# EAGLE design Analog_CAN_Board (EAGLE 8.4.2)
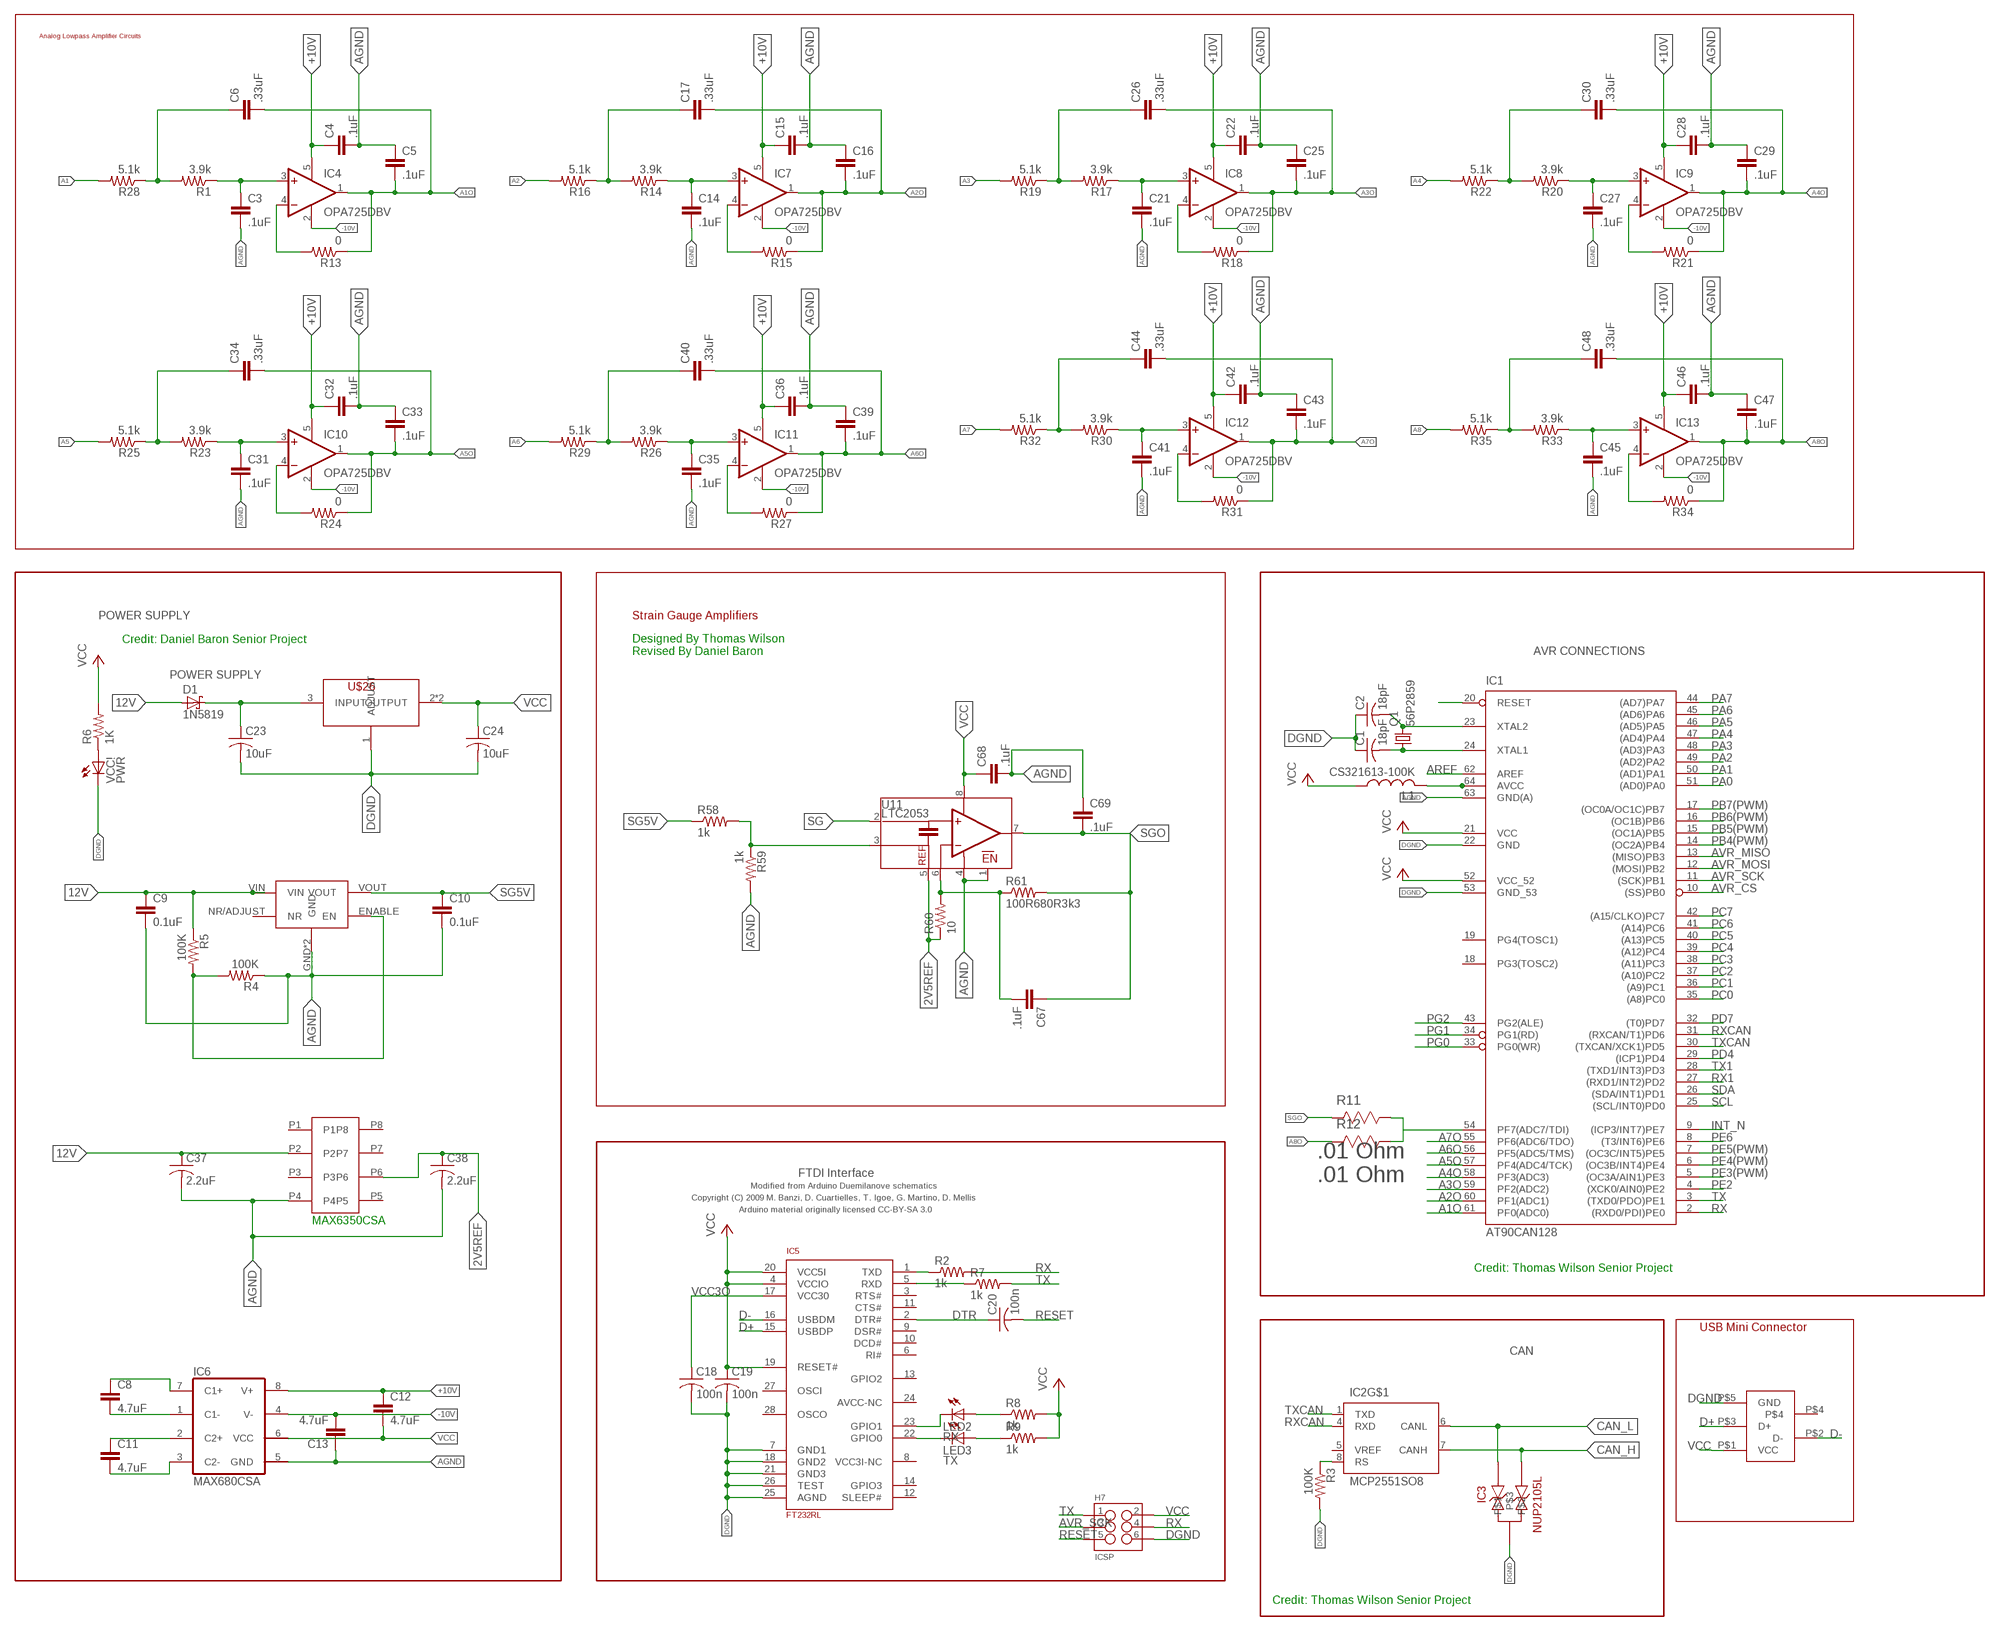
[diagram p0: schematic, sheet 1, part 1 of 2]
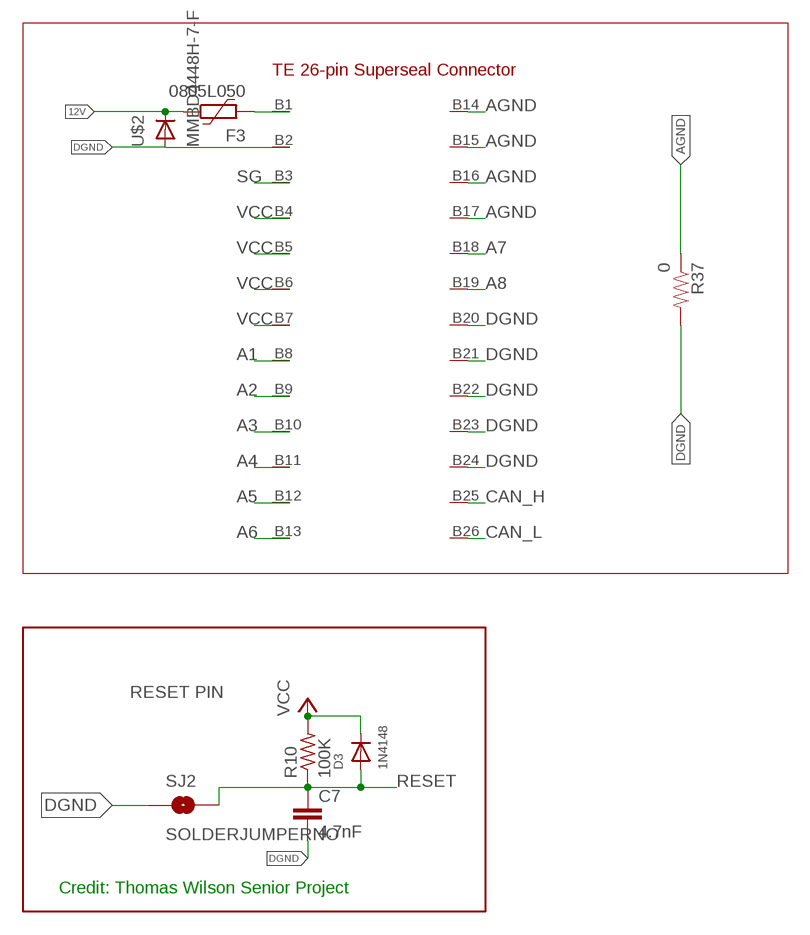
[diagram p1: schematic, sheet 1, part 2 of 2]

## Parts
C1  18pF  C-USC0805  [C0805]
C2  18pF  C-USC0805  [C0805]
C3  .1uF  CAP0603-CAP  [0603-CAP]
C4  .1uF  CAP0603-CAP  [0603-CAP]
C5  .1uF  CAP0603-CAP  [0603-CAP]
C6  .33uF  CAP0603-CAP  [0603-CAP]
C7  4.7nF  CAP0603-CAP  [0603-CAP]
C8  4.7uF  CAP0603-CAP  [0603-CAP]
C9  0.1uF  C-EUC0603  [C0603]
C10  0.1uF  C-EUC0603  [C0603]
C11  4.7uF  CAP0603-CAP  [0603-CAP]
C12  4.7uF  CAP0603-CAP  [0603-CAP]
C13  4.7uF  CAP0603-CAP  [0603-CAP]
C14  .1uF  CAP0603-CAP  [0603-CAP]
C15  .1uF  CAP0603-CAP  [0603-CAP]
C16  .1uF  CAP0603-CAP  [0603-CAP]
C17  .33uF  CAP0603-CAP  [0603-CAP]
C18  100n  C-USC0805  [C0805]
C19  100n  C-USC0805  [C0805]
C20  100n  C-USC0805  [C0805]
C21  .1uF  CAP0603-CAP  [0603-CAP]
C22  .1uF  CAP0603-CAP  [0603-CAP]
C23  10uF  C-USC0603  [C0603]
C24  10uF  C-USC0603  [C0603]
C25  .1uF  CAP0603-CAP  [0603-CAP]
C26  .33uF  CAP0603-CAP  [0603-CAP]
C27  .1uF  CAP0603-CAP  [0603-CAP]
C28  .1uF  CAP0603-CAP  [0603-CAP]
C29  .1uF  CAP0603-CAP  [0603-CAP]
C30  .33uF  CAP0603-CAP  [0603-CAP]
C31  .1uF  CAP0603-CAP  [0603-CAP]
C32  .1uF  CAP0603-CAP  [0603-CAP]
C33  .1uF  CAP0603-CAP  [0603-CAP]
C34  .33uF  CAP0603-CAP  [0603-CAP]
C35  .1uF  CAP0603-CAP  [0603-CAP]
C36  .1uF  CAP0603-CAP  [0603-CAP]
C37  2.2uF  C-USC0603  [C0603]
C38  2.2uF  C-USC0603  [C0603]
C39  .1uF  CAP0603-CAP  [0603-CAP]
C40  .33uF  CAP0603-CAP  [0603-CAP]
C41  .1uF  CAP0603-CAP  [0603-CAP]
C42  .1uF  CAP0603-CAP  [0603-CAP]
C43  .1uF  CAP0603-CAP  [0603-CAP]
C44  .33uF  CAP0603-CAP  [0603-CAP]
C45  .1uF  CAP0603-CAP  [0603-CAP]
C46  .1uF  CAP0603-CAP  [0603-CAP]
C47  .1uF  CAP0603-CAP  [0603-CAP]
C48  .33uF  CAP0603-CAP  [0603-CAP]
C67  .1uF  CAP0603-CAP  [0603-CAP]
C68  .1uF  CAP0603-CAP  [0603-CAP]
C69  .1uF  CAP0603-CAP  [0603-CAP]
D1  1N5819  1N5819-B  [DO41-7.6]
D3  1N4148  DIODESOD-123  [SOD-123]
F3  0805L050  [0805L]
H7  ICSP  M03X2SMD_FCI  [2X3_SMD_FCI_54202-G30]
IC1  AT90CAN128  [TQFP64]
IC2  MCP2551SO8  [SO08]
IC3  NUP2105L  [SOT-23]
IC4  OPA725DBV  [SOT23-5]
IC5  FT232RL  [SSOP28]
IC6  MAX680CSA  [SO08]
IC7  OPA725DBV  [SOT23-5]
IC8  OPA725DBV  [SOT23-5]
IC9  OPA725DBV  [SOT23-5]
IC10  OPA725DBV  [SOT23-5]
IC11  OPA725DBV  [SOT23-5]
IC12  OPA725DBV  [SOT23-5]
IC13  OPA725DBV  [SOT23-5]
L1  CS321613-100K  L-USL3216C  [L3216C]
LED2  RX  LEDCHIPLED_0805  [CHIPLED_0805]
LED3  TX  LEDCHIPLED_0805  [CHIPLED_0805]
Q1  56P2859  CRYSTALSMD  [HC49UP]
R1  3.9k  RESISTOR0603  [0603-RES]
R2  1k  R-US_R0805  [R0805]
R3  100K  R-US_R0805  [R0805]
R4  100K  R-US_M0805  [M0805]
R5  100K  R-US_M0805  [M0805]
R6  1K  R-US_R0805  [R0805]
R7  1k  R-US_R0805  [R0805]
R8  1k  R-US_R0805  [R0805]
R9  1k  R-US_R0805  [R0805]
R10  100K  R-US_R0805  [R0805]
R11  .01 Ohm  WSLP0603R0100FEA  [RESC1608X60N]
R12  .01 Ohm  WSLP0603R0100FEA  [RESC1608X60N]
R13  0  RESISTOR0603  [0603-RES]
R14  3.9k  RESISTOR0603  [0603-RES]
R15  0  RESISTOR0603  [0603-RES]
R16  5.1k  RESISTOR0603  [0603-RES]
R17  3.9k  RESISTOR0603  [0603-RES]
R18  0  RESISTOR0603  [0603-RES]
R19  5.1k  RESISTOR0603  [0603-RES]
R20  3.9k  RESISTOR0603  [0603-RES]
R21  0  RESISTOR0603  [0603-RES]
R22  5.1k  RESISTOR0603  [0603-RES]
R23  3.9k  RESISTOR0603  [0603-RES]
R24  0  RESISTOR0603  [0603-RES]
R25  5.1k  RESISTOR0603  [0603-RES]
R26  3.9k  RESISTOR0603  [0603-RES]
R27  0  RESISTOR0603  [0603-RES]
R28  5.1k  RESISTOR0603  [0603-RES]
R29  5.1k  RESISTOR0603  [0603-RES]
R30  3.9k  RESISTOR0603  [0603-RES]
R31  0  RESISTOR0603  [0603-RES]
R32  5.1k  RESISTOR0603  [0603-RES]
R33  3.9k  RESISTOR0603  [0603-RES]
R34  0  RESISTOR0603  [0603-RES]
R35  5.1k  RESISTOR0603  [0603-RES]
R37  0  RESISTOR0603  [0603-RES]
R58  1k  RESISTOR0603  [0603-RES]
R59  1k  RESISTOR0603  [0603-RES]
R60  10  RESISTOR0603  [0603-RES]
R61  100R680R3k3  RESISTOR0603  [0603-RES]
SJ2  SOLDERJUMPERNO  [SJ_2S-NO]
U11  LTC2053  [MSOP8]
U$1  1734753-1_MINIUSB_CON  [1734753-1_MINIUSB_CON]
U$2  MMBD4448H-7-F  [SOT23-3]
U$3  SUPERSEAL1.0_26POS  [SUPERSEAL1.0_26POS]
U$5  REG-104GA-5  [REG104GA-5]
U$10V2V5  MAX6350CSA  [8-SOIC]
U$26  NCP1117  [SOT-223-4]
VCC!  PWR  LEDCHIPLED_0805  [CHIPLED_0805]

## Nets
2V5REF: C38.1 R60.1 U11.5(REF) U$10V2V5.P6
5V_REG_IN: C23.1 D1.C U$26.3(INPUT)
12V: C9.1 C37.1 D1.A F3.1 R5.1 U$2.3(C) U$5.VIN U$10V2V5.P2
+10V: C4.1 C12.1 C15.1 C22.1 C28.1 C32.1 C36.1 C42.1 C46.1 IC4.5(V+) IC6.8(V+) IC7.5(V+) IC8.5(V+) IC9.5(V+) IC10.5(V+) IC11.5(V+) IC12.5(V+) IC13.5(V+)
-10V: C13.2 IC4.2(V-) IC6.4(V-) IC7.2(V-) IC8.2(V-) IC9.2(V-) IC10.2(V-) IC11.2(V-) IC12.2(V-) IC13.2(V-)
A1: R28.2 U$3.B8
A1O: C5.2 C6.2 IC1.61(PF0(ADC0)) IC4.1(OUT) R13.1
A2: R16.2 U$3.B9
A2O: C16.2 C17.2 IC1.60(PF1(ADC1)) IC7.1(OUT) R15.1
A3: R19.2 U$3.B10
A3O: C25.2 C26.2 IC1.59(PF2(ADC2)) IC8.1(OUT) R18.1
A4: R22.2 U$3.B11
A4O: C29.2 C30.2 IC1.58(PF3(ADC3)) IC9.1(OUT) R21.1
A5: R25.2 U$3.B12
A5O: C33.2 C34.2 IC1.57(PF4(ADC4/TCK)) IC10.1(OUT) R24.1
A6: R29.2 U$3.B13
A6O: C39.2 C40.2 IC1.56(PF5(ADC5/TMS)) IC11.1(OUT) R27.1
A7: R32.2 U$3.B18
A7O: C43.2 C44.2 IC1.55(PF6(ADC6/TDO)) IC12.1(OUT) R31.1
A8: R35.2 U$3.B19
A8O: C47.2 C48.2 IC13.1(OUT) R12.2 R34.1
AGND: C3.2 C4.2 C5.1 C9.2 C10.2 C13.1 C14.2 C15.2 C16.1 C21.2 C22.2 C25.1 C27.2 C28.2 C29.1 C31.2 C32.2 C33.1 C35.2 C36.2 C37.2 C38.2 C39.1 C41.2 C42.2 C43.1 C45.2 C46.2 C47.1 C68.2 C69.1 IC1.63(GND(A)) IC6.5(GND) R4.1 R37.1 R59.2 U11.1(EN) U11.4(V-) U$3.B14 U$3.B15 U$3.B16 U$3.B17 U$5.GND U$5.HEATGND(GND) U$10V2V5.P4
AREF: IC1.62(AREF)
AVR_CS: IC1.10((SS)PB0)
AVR_MISO: IC1.13((MISO)PB3)
AVR_MOSI: IC1.12((MOSI)PB2)
AVR_SCK: H7.3 IC1.11((SCK)PB1)
CAN_H: IC2.7(CANH) IC3.2 U$3.B25
CAN_L: IC2.6(CANL) IC3.1 U$3.B26
D+: IC5.15(USBDP) U$1.P$3(D+)
D-: IC5.16(USBDM) U$1.P$2(D-)
DGND: C1.1 C2.1 C7.2 C18.2 C19.2 C23.2 C24.2 H7.6 IC1.22(GND) IC1.53(GND_53) IC3.3 IC5.7(GND1) IC5.18(GND2) IC5.21(GND3) IC5.25(AGND) IC5.26(TEST) R3.2 R37.2 SJ2.1 U$1.P$5(GND) U$2.1(A) U$3.B2 U$3.B20 U$3.B21 U$3.B22 U$3.B23 U$3.B24 U$26.1(ADJUST) VCC!.C
DTR: C20.1 IC5.2(DTR#)
INT_N: IC1.9((ICP3/INT7)PE7)
M8RXD: IC5.1(TXD) R2.1
M8TXD: IC5.5(RXD) R7.1
N$1: F3.2 U$3.B1
N$2: R4.2 R5.2 U$5.ENABLE(EN)
N$5: C6.1 R1.2 R28.1
N$6: IC2.8(RS) R3.1
N$9: R6.1 VCC!.A
N$11: C1.2 IC1.24(XTAL1) Q1.1
N$17: C3.1 IC4.3(+IN) R1.1
N$18: IC1.54(PF7(ADC7/TDI)) R11.1 R12.1
N$19: IC4.4(-IN) R13.2
N$20: C8.1 IC6.7(C1+)
N$21: C11.1 IC6.2(C2+)
N$22: IC1.64(AVCC) L1.2
N$23: C8.2 IC6.1(C1-)
N$24: C11.2 IC6.3(C2-)
N$25: C14.1 IC7.3(+IN) R14.1
N$26: IC7.4(-IN) R15.2
N$27: C17.1 R14.2 R16.1
N$28: R58.2 R59.1 U11.3(+IN)
N$29: C67.2 R60.2 R61.1 U11.6(RG)
N$30: C21.1 IC8.3(+IN) R17.1
N$31: IC8.4(-IN) R18.2
N$32: IC5.23(GPIO1) LED2.C
N$33: C26.1 R17.2 R19.1
N$34: IC5.22(GPIO0) LED3.C
N$35: LED2.A R8.1
N$36: LED3.A R9.1
N$37: C27.1 IC9.3(+IN) R20.1
N$38: IC9.4(-IN) R21.2
N$39: C30.1 R20.2 R22.1
N$40: C31.1 IC10.3(+IN) R23.1
N$41: IC10.4(-IN) R24.2
N$42: C34.1 R23.2 R25.1
N$43: C35.1 IC11.3(+IN) R26.1
N$44: IC11.4(-IN) R27.2
N$45: C40.1 R26.2 R29.1
N$46: C41.1 IC12.3(+IN) R30.1
N$47: IC12.4(-IN) R31.2
N$48: C44.1 R30.2 R32.1
N$49: C45.1 IC13.3(+IN) R33.1
N$50: IC13.4(-IN) R34.2
N$51: C48.1 R33.2 R35.1
PA0: IC1.51((AD0)PA0)
PA1: IC1.50((AD1)PA1)
PA2: IC1.49((AD2)PA2)
PA3: IC1.48((AD3)PA3)
PA4: IC1.47((AD4)PA4)
PA5: IC1.46((AD5)PA5)
PA6: IC1.45((AD6)PA6)
PA7: IC1.44((AD7)PA7)
PB4(PWM): IC1.14((OC2A)PB4)
PB5(PWM): IC1.15((OC1A)PB5)
PB6(PWM): IC1.16((OC1B)PB6)
PB7(PWM): IC1.17((OC0A/OC1C)PB7)
PC0: IC1.35((A8)PC0)
PC1: IC1.36((A9)PC1)
PC2: IC1.37((A10)PC2)
PC3: IC1.38((A11)PC3)
PC4: IC1.39((A12)PC4)
PC5: IC1.40((A13)PC5)
PC6: IC1.41((A14)PC6)
PC7: IC1.42((A15/CLKO)PC7)
PD4: IC1.29((ICP1)PD4)
PD7: IC1.32((T0)PD7)
PE2: IC1.4((XCK0/AIN0)PE2)
PE3(PWM): IC1.5((OC3A/AIN1)PE3)
PE4(PWM): IC1.6((OC3B/INT4)PE4)
PE5(PWM): IC1.7((OC3C/INT5)PE5)
PE6: IC1.8((T3/INT6)PE6)
PG0: IC1.33(PG0(WR))
PG1: IC1.34(PG1(RD))
PG2: IC1.43(PG2(ALE))
RESET: C7.1 C20.2 D3.A H7.5 IC1.20(RESET) R10.1 SJ2.2
RX: H7.4 IC1.2((RXD0/PDI)PE0) R2.2
RX1: IC1.27((RXD1/INT2)PD2)
RXCAN: IC1.31((RXCAN/T1)PD6) IC2.4(RXD)
SCL: IC1.25((SCL/INT0)PD0)
SDA: IC1.26((SDA/INT1)PD1)
SG: U11.2(-IN) U$3.B3
SG5V: C10.1 R58.1 U$5.VOUT
SGO: C67.1 C69.2 R11.2 R61.2 U11.7(OUT)
TX: H7.1 IC1.3((TXD0/PDO)PE1) R7.2
TX1: IC1.28((TXD1/INT3)PD3)
TXCAN: IC1.30((TXCAN/XCK1)PD5) IC2.1(TXD)
VCC: C12.2 C19.1 C24.1 C68.1 D3.C H7.2 IC1.21(VCC) IC1.52(VCC_52) IC5.4(VCCIO) IC5.19(RESET#) IC5.20(VCC5I) IC6.6(VCC) L1.1 R6.2 R8.2 R9.2 R10.2 U11.8(V+) U$1.P$1(VCC) U$3.B4 U$3.B5 U$3.B6 U$3.B7 U$26.2(OUTPUT) U$26.4(OUTPUT)
VCC3O: C18.1 IC5.17(VCC30)
XTAL1: C2.2 IC1.23(XTAL2) Q1.2
Unconnected: IC1.18(PG3(TOSC2)) IC1.19(PG4(TOSC1)) IC2.5(VREF) IC5.3(RTS#) IC5.6(RI#) IC5.8(VCC3I-NC) IC5.9(DSR#) IC5.10(DCD#) IC5.11(CTS#) IC5.12(SLEEP#) IC5.13(GPIO2) IC5.14(GPIO3) IC5.24(AVCC-NC) IC5.27(OSCI) IC5.28(OSCO) U$1.P$4 U$5.NR/ADJUST(NR) U$10V2V5.P1 U$10V2V5.P3 U$10V2V5.P5 U$10V2V5.P7 U$10V2V5.P8

## Notes on the sheet
- Analog Lowpass Amplifier Circuits
- TE 26-pin Superseal Connector
- POWER SUPPLY | Strain Gauge Amplifiers
- Credit: Daniel Baron Senior Project
- Designed By Thomas Wilson
  Revised By Daniel Baron
- AVR CONNECTIONS
- POWER SUPPLY
- RESET PIN
- Credit: Thomas Wilson Senior Project
- FTDI Interface
- Modified from Arduino Duemilanove schematics
- Copyright (C) 2009 M. Banzi, D. Cuartielles, T. Igoe, G. Martino, D. Mellis
- Arduino material originally licensed CC-BY-SA 3.0
- MAX6350CSA
- Credit: Thomas Wilson Senior Project
- USB Mini Connector
- CAN
- Credit: Thomas Wilson Senior Project

## Power pins joined to a net without a drawn wire
AGND: IC2.2(GND)
VCC: IC2.3(VCC)

## Library data of the parts
C1 C2 C18-C20 C23 C24 C37 C38 = rcl:C-US: CAPACITOR, American symbol
C3-C6 C8 C11-C17 C21 C22 C25-C36 C39-C48 C67-C69 = SparkFun-Passives:CAP: Capacitor Standard 0603 ceramic capacitor, and 0.1" leaded capacitor.
C7 = SparkFun-Capacitors:CAP: Capacitor Standard 0603 ceramic capacitor, and 0.1" leaded capacitor.
C9 C10 = rcl:C-EU: CAPACITOR, European symbol
D1 = diode:1N581*: 1.0A SCHOTTKY BARRIER RECTIFIER Source: http://www.diodes.com/datasheets/ds23001.pdf
D3 = adafruit:DIODE: Diode SMADIODE - SMA Surface Mount Package 20V 1A Schottky Diode Digikey: 641-1014-6-ND DO-1N4148 - Through Hole Small Current Diode SOD-123 20V 1 A (.5mV Vf) Schottky Diode - Digikey: MBRX120TPMSCT-ND SOD-323 10V 570mA (.38mV Vf, 3ns) Schottky Diode - Digikey: ZLLS410CT-ND SOD-523 30V 30mA Schottky Diode (RB751S-40TE61) - Digikey: RB751S-40TE61CT-ND SOT23-R/W - SOT23 Package (R = Solder Paste/Reflow Ovens, W = Hand-Soldering) BAT54Film 40V 300mA - Digikey: 497-7162-1-ND
F3 = LittleFuse:?: Polyfuse Resettable PTC Source: http://www.littelfuse.com/products/resettable-ptcs.aspx; MF: Littelfuse; MPN: 0805L050; OC_FARNELL: 1832103; OC_NEWARK: 18M4776
H7 = SparkFun-Connectors:M03X2: 2x3 .1" header. Shrouded, with keying- CONN-10681 SMT- CONN-11415 Pogo pins- HW-11044
IC1 = at90can128:AT90CAN128
IC2 = can:MCP2551: CAN Tranceiver Microchip
IC3 = Artificial Science:NUP2105L
IC4 IC7-IC13 = linear:OPA725: Very Low Noise, High-Speed, 12V CMOS Operational Amplifier Source: http://focus.ti.com/lit/ds/symlink/opa725.pdf
IC5 = SmartPrj:FT232RL
IC6 = maxim:MAX680CSA: Switched-capcitor VOLTAGE CONVERTER; MF: MAXIM; MPN: MAX680CSA; OC_FARNELL: 9725717; OC_NEWARK: 34C3975
L1 = rcl:L-US: INDUCTOR, American symbol
LED2 LED3 VCC! = led:LED: LED OSRAM: - CHIPLED LG R971, LG N971, LY N971, LG Q971, LY Q971, LO R971, LY R971 LH N974, LH R974 LS Q976, LO Q976, LY Q976 LO Q996 - Hyper CHIPLED LW Q18S LB Q993, LB Q99A, LB R99A - SideLED LS A670, LO A670, LY A670, LG A670, LP A670 LB A673, LV A673, LT A673, LW A673 LH A674 LY A675 LS A676, LA A676, LO A676, LY A676, LW A676 LS A679, LY A679, LG A679 - Hyper Micro SIDELED® LS Y876, LA Y876, LO Y876, LY Y876 LT Y87S - SmartLED LW L88C, LW L88S LB L89C, LB L89S, LG L890 LS L89K, LO L89K, LY L89K LS L896, LA L896, LO L896, LY L896 - TOPLED LS T670, LO T670, LY T670, LG T670, LP T670 LSG T670, LSP T670, LSY T670, LOP T670, LYG T670 LG T671, LOG T671, LSG T671 LB T673, LV T673, LT T673, LW T673 LH T674 LS T676, LA T676, LO T676, LY T676, LB T676, LH T676, LSB T676, LW T676 LB T67C, LV T67C, LT T67C, LS T67K, LO T67K, LY T67K, LW E67C LS E67B, LA E67B, LO E67B, LY E67B, LB E67C, LV E67C, LT E67C LW T67C LS T679, LY T679, LG T679 LS T770, LO T770, LY T770, LG T770, LP T770 LB T773, LV T773, LT T773, LW T773 LH T774 LS E675, LA E675, LY E675, LS T675 LS T776, LA T776, LO T776, LY T776, LB T776 LHGB T686 LT T68C, LB T68C - Hyper Mini TOPLED® LB M676 - Mini TOPLED Santana® LG M470 LS M47K, LO M47K, LY M47K Source: http://www.osram.convergy.de LUXEON: - LUMILED® LXK2-PW12-R00, LXK2-PW12-S00, LXK2-PW14-U00, LXK2-PW14-V00 LXK2-PM12-R00, LXK2-PM12-S00, LXK2-PM14-U00 LXK2-PE12-Q00, LXK2-PE12-R00, LXK2-PE12-S00, LXK2-PE14-T00, LXK2-PE14-U00 LXK2-PB12-K00, LXK2-PB12-L00, LXK2-PB12-M00, LXK2-PB14-N00, LXK2-PB14-P00, LXK2-PB14-Q00 LXK2-PR12-L00, LXK2-PR12-M00, LXK2-PR14-Q00, LXK2-PR14-R00 LXK2-PD12-Q00, LXK2-PD12-R00, LXK2-PD12-S00 LXK2-PH12-R00, LXK2-PH12-S00 LXK2-PL12-P00, LXK2-PL12-Q00, LXK2-PL12-R00 Source: www.luxeon.com KINGBRIGHT: KA-3528ASYC Source: www.kingbright.com
Q1 = SparkFun-FreqCtrl:CRYSTAL: Various standard crystals. Proven footprints. Spark Fun Electronics SKU : COM-00534
R1 R13-R35 R37 R58-R61 = SparkFun-Resistors:RESISTOR: Resistor Basic schematic elements and footprints for 0603, 1206, and PTH resistors.
R2-R10 = rcl:R-US_: RESISTOR, American symbol
R11 R12 = Vishay_By_element14_Batch_1:WSLP0603R0100FEA: RESISTOR, 0603; MPN: WSLP0603R0100FEA; OC_FARNELL: -; OC_NEWARK: 05T6644; SUPPLIER: VISHAY DALE; TOLERANCE: ± 1.0 %; WATTAGE: 0.4W
SJ2 = SparkFun-Passives:SOLDERJUMPER: Solder Jumper Standard SMD solder jumper. Used to automate production. Two varients : Normally Open and Normally Closed are the same, but have different paste layers. NC will have a large amount of paste and should jumper during reflow.
U11 = linear-technology:LTC2053: DK: LTC2053CMS8#PBF-ND
U$1 = us-te-con:1734753-1_MINIUSB_CON
U$2 = diodes-inc:MMBD4448H-7-F
U$3 = TE:SUPERSEAL1.0_26POS
U$5 = DashAndCAN library:REG-104GA-5
U$10V2V5 = DashAndCAN library:MAX6350CSA
U$26 = on-semiconductor:NCP1117

## Board
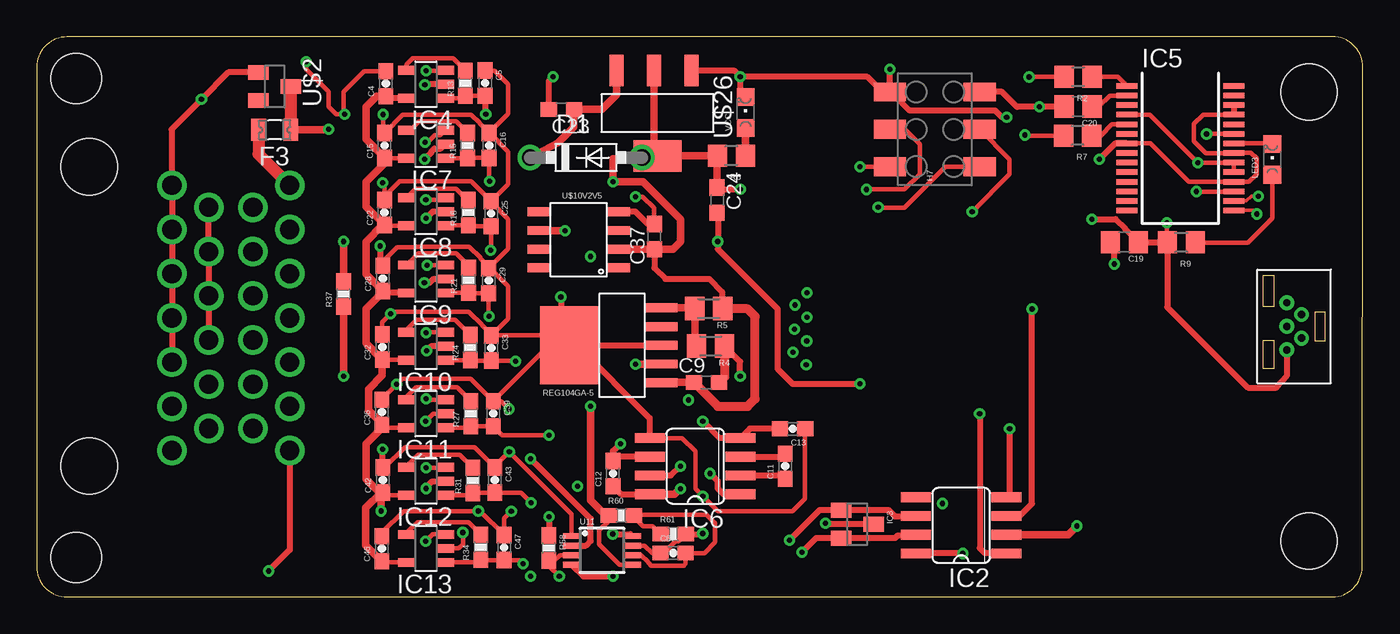
[diagram p2: board, top side]
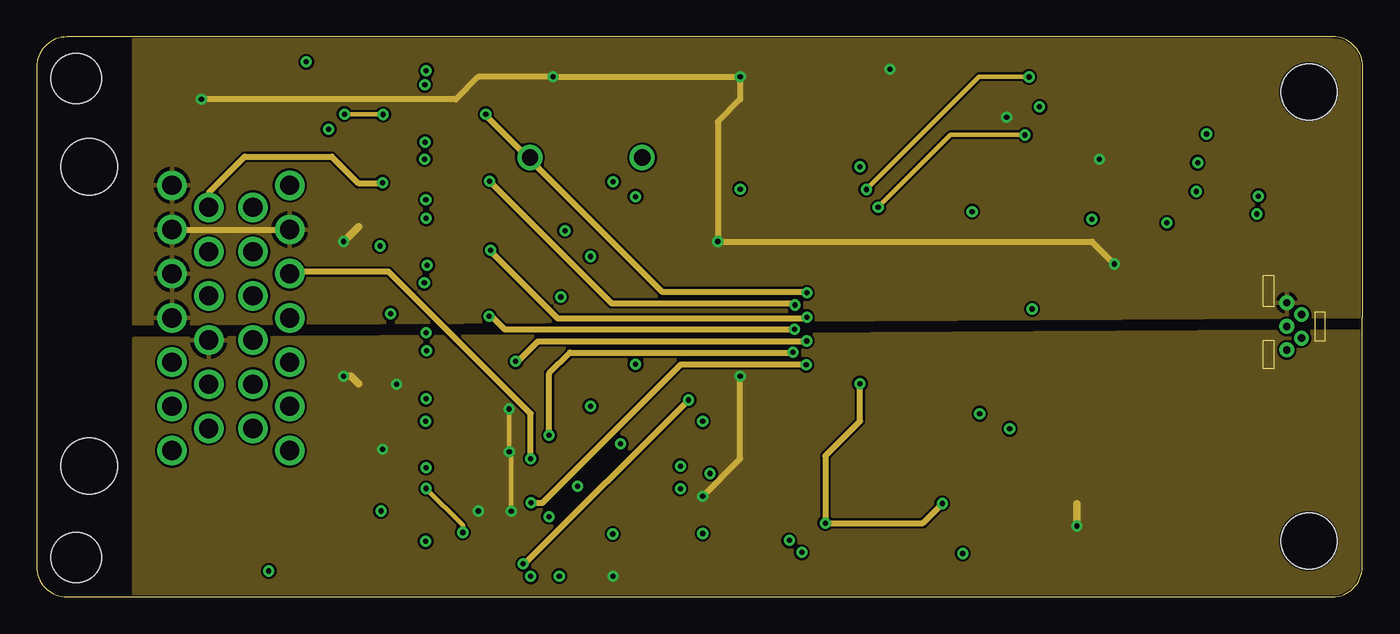
[diagram p3: board, inner layer TopMiddle]
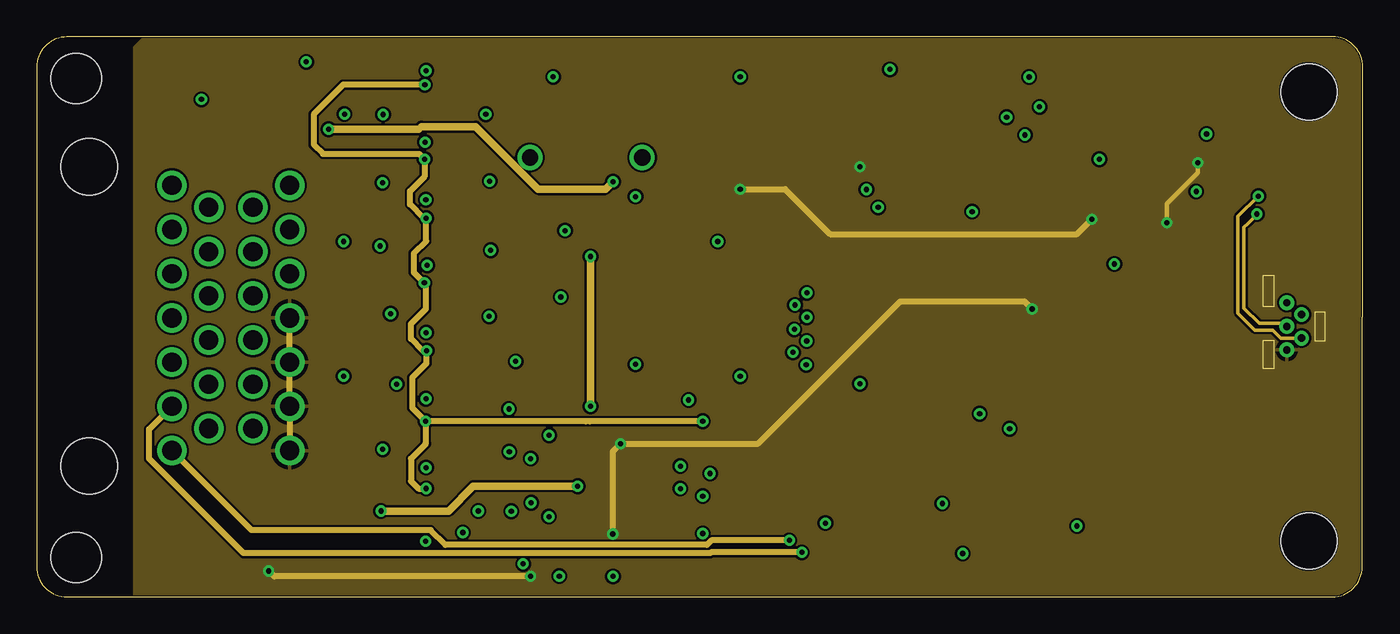
[diagram p4: board, inner layer BottomMiddle]
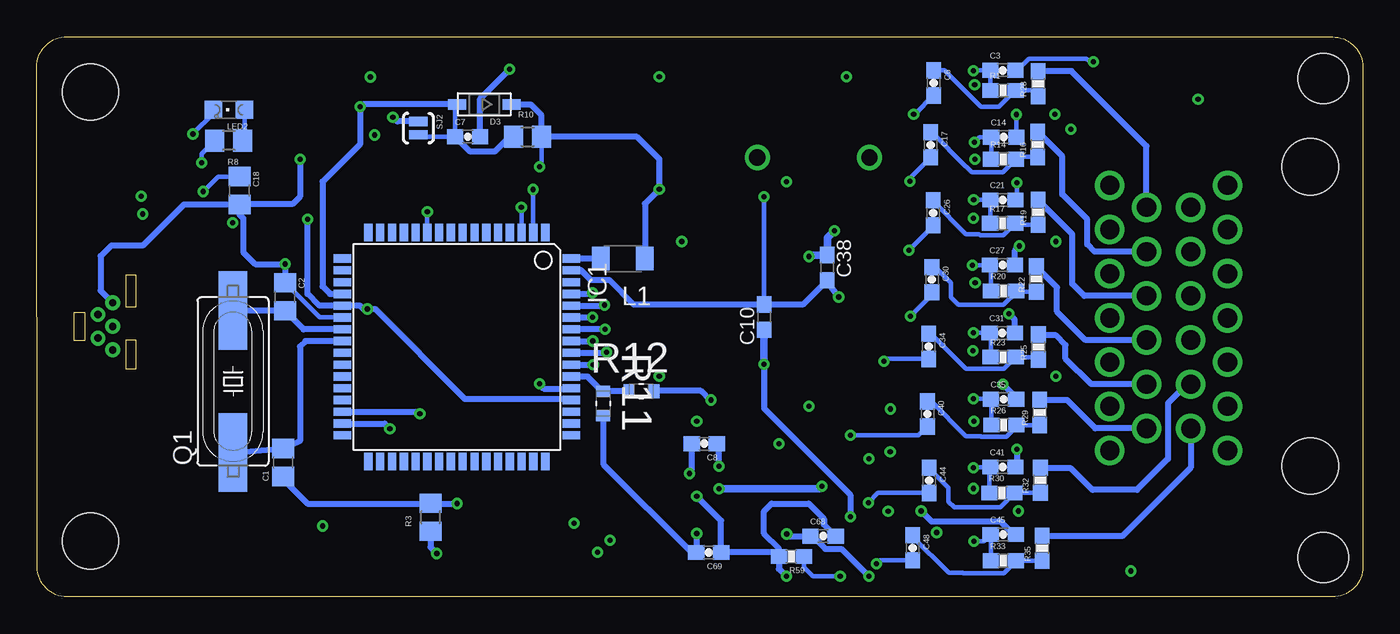
[diagram p5: board, bottom side, seen from below]

Size 90.01 x 38.01 mm. Coordinates in mm from the lower left corner, seen from the top.
Outline: 0,35.97 0,2.03 arc90 2.03,0 87.95,0 arc90 89.98,2.03 90.01,35.98 arc90 87.98,38.01 2.03,38 arc90 0,35.97
Copper layers (1*6*11*16): Top 0.053340625mm / dielectric 7.5mil / TopMiddle 0.035559375mm / dielectric 40mil / BottomMiddle 0.035559375mm / dielectric 7.5mil / Bottom 0.053340625mm
Design rules "default *": minimum track width 6mil, minimum drill 0.35mm, track to track 6mil, track to pad 6mil, pad to pad 6mil, via to via 6mil, smd to smd 6mil, copper to edge 4mil, drill to drill 6mil, minimum pad ring 10mil, minimum via ring 8mil, stop-mask expansion 4mil, vias tented up to drill 0mil, thermal gap 10mil
Holes 3.81 mm at 3.56,29.2 3.56,8.88 86.36,34.28 86.36,3.8

### Footprints (pad centres in the part's own frame; a part is rotated, then mirrored left to right if it is on the bottom)
C0805 = smd 1.3 x 1.5: 1 -0.95,0; 2 0.95,0
0603-CAP = smd 1.1 x 1: 1 -0.85,0; 2 0.85,0
C0603 = smd 1.1 x 1: 1 -0.85,0; 2 0.85,0
DO41-7.6 = drill 1.1 pad 1.7: A 3.81,0; C -3.81,0
SOD-123 = smd 1.2 x 0.7: A 1.85,0; C -1.85,0
0805L = smd 1 x 1.5: 1 -1.1,0; 2 1.1,0
2X3_SMD_FCI_54202-G30 = smd 1.27 x 2.18: 1 -2.54,-3.05; 2 -2.54,3.05; 3 0,-3.05; 4 0,3.05; 5 2.54,-3.05; 6 2.54,3.05
TQFP64 = smd 1.194 x 0.559: 1 -7.76,6; 2 -7.76,5.2; 3 -7.76,4.4; 4 -7.76,3.6; 5 -7.76,2.8; 6 -7.76,2; 7 -7.76,1.2; 8 -7.76,0.4; 9 -7.76,-0.4; 10 -7.76,-1.2; 11 -7.76,-2; 12 -7.76,-2.8; 13 -7.76,-3.6; 14 -7.76,-4.4; 15 -7.76,-5.2; 16 -7.76,-6; 33 7.76,-6; 34 7.76,-5.2; 35 7.76,-4.4; 36 7.76,-3.6; 37 7.76,-2.8; 38 7.76,-2; 39 7.76,-1.2; 40 7.76,-0.4; 41 7.76,0.4; 42 7.76,1.2; 43 7.76,2; 44 7.76,2.8; 45 7.76,3.6; 46 7.76,4.4; 47 7.76,5.2; 48 7.76,6 | smd 0.559 x 1.194: 17 -6,-7.76; 18 -5.2,-7.76; 19 -4.4,-7.76; 20 -3.6,-7.76; 21 -2.8,-7.76; 22 -2,-7.76; 23 -1.2,-7.76; 24 -0.4,-7.76; 25 0.4,-7.76; 26 1.2,-7.76; 27 2,-7.76; 28 2.8,-7.76; 29 3.6,-7.76; 30 4.4,-7.76; 31 5.2,-7.76; 32 6,-7.76; 49 6,7.76; 50 5.2,7.76; 51 4.4,7.76; 52 3.6,7.76; 53 2.8,7.76; 54 2,7.76; 55 1.2,7.76; 56 0.4,7.76; 57 -0.4,7.76; 58 -1.2,7.76; 59 -2,7.76; 60 -2.8,7.76; 61 -3.6,7.76; 62 -4.4,7.76; 63 -5.2,7.76; 64 -6,7.76
SO08 = smd 0.66 x 2.032: 1 -1.905,-3.073; 2 -0.635,-3.073; 3 0.635,-3.073; 4 1.905,-3.073; 5 1.905,3.073; 6 0.635,3.073; 7 -0.635,3.073; 8 -1.905,3.073
SOT-23 = smd 1 x 1.4: 1 -0.95,-1.1; 2 0.95,-1.1; 3 0,1.1
SOT23-5 = smd 0.6 x 1.2: 1 -0.95,-1.306; 2 0,-1.306; 3 0.95,-1.306; 4 0.95,1.306; 5 -0.95,1.306
SSOP28 = smd 0.381 x 1.499: 1 -4.225,-3.625; 2 -3.575,-3.625; 3 -2.925,-3.625; 4 -2.275,-3.625; 5 -1.625,-3.625; 6 -0.975,-3.625; 7 -0.325,-3.625; 8 0.325,-3.625; 9 0.975,-3.625; 10 1.625,-3.625; 11 2.275,-3.625; 12 2.925,-3.625; 13 3.575,-3.625; 14 4.225,-3.625; 15 4.225,3.625; 16 3.575,3.625; 17 2.925,3.625; 18 2.275,3.625; 19 1.625,3.625; 20 0.975,3.625; 21 0.325,3.625; 22 -0.325,3.625; 23 -0.975,3.625; 24 -1.625,3.625; 25 -2.275,3.625; 26 -2.925,3.625; 27 -3.575,3.625; 28 -4.225,3.625
L3216C = smd 1.2 x 1.6: 1 -1.5,0; 2 1.5,0
CHIPLED_0805 = smd 1.2 x 1.2: A 0,-1.05; C 0,1.05
HC49UP = smd 5.334 x 1.93: 1 -4.826,0; 2 4.826,0
0603-RES = smd 1.1 x 1: 1 -0.85,0; 2 0.85,0
R0805 = smd 1.3 x 1.5: 1 -0.95,0; 2 0.95,0
M0805 = smd 1.3 x 1.6: 1 -0.95,0; 2 0.95,0
RESC1608X60N = smd 0.762 x 0.94: 1 -0.838,0; 2 0.838,0
SJ_2S-NO = smd 0.635 x 1.27: 1 -0.45,0; 2 0.45,0
MSOP8 = smd 0.4 x 1.2: 1 -0.975,-2.05; 2 -0.325,-2.05; 3 0.325,-2.05; 4 0.975,-2.05; 5 0.975,2.05; 6 0.325,2.05; 7 -0.325,2.05; 8 -0.975,2.05
1734753-1_MINIUSB_CON = drill 0.5: P$1 -0.5,-1.6; P$2 0.5,-0.8; P$3 -0.5,0; P$4 0.5,0.8; P$5 -0.5,1.6
SOT23-3 = smd 1 x 1.4: 1 -0.95,-1.1; 2 0.95,-1.1; 3 0,1.1
SUPERSEAL1.0_26POS = drill 1.3 pad 2: B1 -9.17,4.73; B2 -6.17,4.73; B3 -3.17,4.73; B4 -0.17,4.73; B5 2.83,4.73; B6 5.83,4.73; B7 8.83,4.73; B8 -7.67,2.23; B9 -4.67,2.23; B10 -1.67,2.23; B11 1.33,2.23; B12 4.33,2.23; B13 7.33,2.23; B14 -7.67,-0.77; B15 -4.67,-0.77; B16 -1.67,-0.77; B17 1.33,-0.77; B18 4.33,-0.77; B19 7.33,-0.77; B20 -9.17,-3.27; B21 -6.17,-3.27; B22 -3.17,-3.27; B23 -0.17,-3.27; B24 2.83,-3.27; B25 5.83,-3.27; B26 8.83,-3.27 | hole 3.4: -16.42,-9.77; 16.08,-9.77
REG104GA-5 = smd 0.6 x 2.2: ENABLE 2.54,-6.2; GND 0,-6.2; NR/ADJUST 1.27,-6.2; VIN -2.54,-6.2; VOUT -1.27,-6.2 | smd 5.3 x 4: HEATGND 0,0
8-SOIC = smd 0.6 x 1.55: P1 -1.905,-2.7; P2 -0.635,-2.7; P3 0.635,-2.7; P4 1.905,-2.7; P5 1.905,2.7; P6 0.635,2.7; P7 -0.635,2.7; P8 -1.905,2.7
SOT-223-4 = smd 0.95 x 2.15: 1 -2.3,-2.9; 2 0.24,-2.9; 3 2.78,-2.9 | smd 3.25 x 2.15: 4 0,2.9

### Placement (x,y rotation side)
C1  73.28,9.12 90 bottom
C2  73.16,20.38 270 bottom
C3  24.43,35.74 0 bottom
C4  23.69,34.83 90 top
C5  30.43,34.87 270 top
C6  29.13,34.88 270 bottom
C7  60.76,31.23 0 bottom
C8  44.7,10.4 180 bottom
C9  45.46,14.56 0 top
C10  40.63,18.99 90 bottom
C11  50.8,8.88 90 top
C12  39.12,8.37 90 top
C13  51.31,11.42 180 top
C14  24.37,31.2 0 bottom
C15  23.61,30.64 90 top
C16  30.71,30.64 270 top
C17  29.32,30.68 270 bottom
C18  76.25,27.58 270 bottom
C19  73.84,24.08 180 top
C20  70.69,33.28 180 top
C21  24.43,26.94 0 bottom
C22  23.61,26.09 90 top
C23  35.61,33.08 180 top
C24  46.18,26.93 270 top
C25  30.84,26 270 top
C26  29.16,26.07 270 bottom
C27  24.46,22.52 0 bottom
C28  23.48,21.62 90 top
C29  30.67,21.46 270 top
C30  29.25,21.53 270 bottom
C31  24.47,17.92 0 bottom
C32  23.45,16.96 90 top
C33  30.86,16.89 270 top
C34  29.46,17 270 bottom
C35  24.38,13.41 0 bottom
C36  23.43,12.54 90 top
C37  41.93,24.45 90 top
C38  36.35,22.35 270 bottom
C39  30.99,12.43 270 top
C40  29.55,12.41 270 bottom
C41  24.43,8.81 0 bottom
C42  23.48,7.93 90 top
C43  31.09,7.94 270 top
C44  29.43,7.91 270 bottom
C45  24.4,4.24 0 bottom
C46  23.42,3.28 90 top
C47  31.72,3.35 270 top
C48  30.55,3.33 270 bottom
C67  43.2,2.98 0 top
C68  36.63,4.12 0 bottom
C69  44.4,3.02 180 bottom
D1  37.29,29.82 0 top
D3  59.63,33.43 180 bottom
F3  16.15,31.69 180 top
H7  60.96,31.74 90 top
IC1  61.5,16.96 270 bottom
IC2  62.75,4.85 90 top
IC3  55.71,4.94 270 top
IC4  26.42,34.78 90 top
IC5  77.63,30.45 270 top
IC6  44.7,8.88 90 top
IC7  26.42,30.72 90 top
IC8  26.42,26.15 90 top
IC9  26.42,21.58 90 top
IC10  26.42,17 90 top
IC11  26.42,12.43 90 top
IC12  26.42,7.86 90 top
IC13  26.42,3.29 90 top
L1  50.23,22.96 180 bottom
LED2  76.96,33.06 90 bottom
LED3  83.88,29.7 0 top
Q1  76.69,14.62 90 bottom
R1  24.41,34.38 0 bottom
R2  70.69,35.29 180 top
R3  63.28,5.41 90 bottom
R4  45.74,17.03 180 top
R5  45.62,19.58 180 top
R6  47.15,29.94 180 top
R7  70.66,31.31 180 top
R8  76.97,30.97 180 bottom
R9  77.7,24.06 180 top
R10  56.69,31.23 0 bottom
R11  51.56,13.13 270 bottom
R12  48.97,13.96 0 bottom
R13  29.1,34.86 90 top
R14  24.38,29.7 0 bottom
R15  29.25,30.64 90 top
R16  22.06,30.71 90 bottom
R17  24.44,25.35 0 bottom
R18  29.29,26.08 90 top
R19  22.04,26.11 90 bottom
R20  24.38,20.77 0 bottom
R21  29.32,21.49 90 top
R22  22.16,21.57 90 bottom
R23  24.4,16.27 0 bottom
R24  29.42,16.93 90 top
R25  22.01,16.96 90 bottom
R26  24.36,11.66 0 bottom
R27  29.46,12.43 90 top
R28  22.03,34.83 90 bottom
R29  21.93,12.52 90 bottom
R30  24.49,7.06 0 bottom
R31  29.6,7.91 90 top
R32  21.88,7.92 90 bottom
R33  24.39,2.45 0 bottom
R34  30.14,3.38 90 top
R35  21.75,3.3 90 bottom
R37  20.83,20.56 90 top
R58  34.75,3.33 270 top
R59  38.78,2.75 180 bottom
R60  39.68,5.53 0 top
R61  43.2,4.27 0 top
SJ2  64.11,31.82 270 bottom
U11  38.36,3.16 270 top
U$1  85.36,18.36 0 top
U$2  16.15,34.64 270 top
U$3  12.44,18.76 270 top
U$5  36.18,17.07 90 top
U$10V2V5  36.78,24.23 90 top
U$26  42.14,32.83 180 top
VCC!  48.12,32.88 0 top

### Tracks (layer width: path | path; a pad name or v marks a point on that pad's centre or on a via)
2V5REF  (via drill 0.35)
  Top 0.305: R60.1 38.83,5.32 38.83,5.18 38.18,4.54 38.18,3.59 39.57,2.2 40.4,2.2 U11.5
  Top 0.508: v35.86,24.85 34.1,24.85 U$10V2V5.P6 | v37.59,12.94 37.59,6.56 38.83,5.32
  BottomMiddle 0.508: v37.59,12.94 v37.59,23.1
  Bottom 0.508: v35.86,24.85 36.35,24.37 C38.1 37.49,23.2 v37.59,23.1
5V_REG_IN
  Top 0.508: U$26.3 39.36,34.06 38.38,33.08 C23.1 36.43,33.05 36.43,31.88 35.39,30.84 D1.C
12V  (via drill 0.35)
  Top 0.406: C37.1 41.93,22.32 42.67,21.58 45.66,21.58 46.53,20.7 46.53,19.62 R5.1
  Top 0.508: F3.1 19.77,31.69 v19.81,31.74 | D1.A 39.12,29.75 v39.12,28.18 41.15,28.18 43.69,25.64 43.69,24.12 43.18,23.61 C37.1 U$10V2V5.P2 | C9.1 42.4,14.55 U$5.VIN
  Top 0.61: C9.1 46.23,12.94 48.26,12.94 48.77,13.45 48.77,19.04 48.26,19.54 46.6,19.54 R5.1
  Top 0.813: U$2.3 17.25,31.7 F3.1
  BottomMiddle 0.508: v19.81,31.74 25.93,31.74 26.11,31.92 29.79,31.92 34.04,27.67 38.61,27.67 v39.12,28.18
+10V  (via drill 0.35)
  Top 0.305: IC7.5 23.63,29.77 C15.1 | IC8.5 23.65,25.2 C22.1 | C32.1 25.05,16.11 IC10.5 | IC11.5 23.63,11.48 C36.1 | IC12.5 23.43,6.91 23.37,6.97 | IC13.5 23.51,2.34 C46.1
  Top 0.406: IC4.5 23.84,33.83 C4.1 | IC6.8 39.66,6.97 C12.1 | IC9.5 23.63,20.63 C28.1
  Top 0.508: IC6.8 43.31,6.97 v43.69,7.35 | 23.37,6.97 v23.37,5.83 | 23.37,6.97 C42.1 23.36,7.09 22.33,6.05 22.33,3.52 C46.1 | C4.1 23.07,33.98 22.35,33.26 22.35,31.05 C15.1 23.61,29.44 22.35,28.18 22.35,26.5 C22.1 23.48,25.24 22.35,24.12 22.35,21.9 C28.1 23.48,20.68 22.35,19.54 22.35,17.21 C32.1 23.45,15.04 22.52,14.11 22.52,12.67 23.43,11.76 C36.1 23.43,11.47 22.35,10.4 22.35,7.98 23.37,6.97
  BottomMiddle 0.508: v36.72,7.51 29.62,7.51 27.94,5.83 v23.37,5.83
  Bottom 0.508: v43.69,7.35 36.88,7.35 v36.72,7.51
-10V  (via drill 0.35)
  Top 0.305: IC11.2 26.9,12.43 v26.39,11.92 | IC13.2 28.64,3.29 28.93,3.58 28.93,4.36 v28.92,4.37
  Top 0.406: C13.2 48.41,11.42 IC6.4 46.35,10.78 v45.21,11.92 | v26.43,7.36 26.43,7.43 26.85,7.85 27.71,7.85 IC12.2 | IC10.2 26.75,17 v26.46,16.71 | v26.31,21.31 26.66,21.31 26.92,21.58 IC9.2 | IC8.2 26.88,26.15 v26.43,25.7 | IC7.2 27.43,30.43 26.98,30.43 26.77,30.22 26.77,30.15 v26.33,29.71 | IC4.2 26.37,34.78 v26.34,34.76
  TopMiddle 0.305: v28.92,4.37 28.92,4.86 v26.43,7.36
  BottomMiddle 0.406: v45.21,11.92 38.12,11.92 37.55,11.91 37.26,11.91 37.06,11.92 26.92,11.92 v26.39,11.92 | v26.43,7.36 v26.43,7.35 25.91,7.35 25.4,7.86 25.4,9.38 26.42,10.4 26.39,10.42 v26.39,11.92 | v26.39,11.92 25.49,12.83 25.49,14.88 26.46,15.85 v26.46,16.71 26.2,16.71 25.4,17.51 25.4,18.53 26.42,19.54 26.42,21.2 v26.31,21.31 25.59,22.03 25.59,23.31 26.43,24.15 v26.43,25.7 26.27,25.7 25.34,26.63 25.34,27.54 26.32,28.52 26.32,29.7 v26.33,29.71 25.96,30.07 19.43,30.07 18.8,30.7 18.8,32.75 20.8,34.76 v26.34,34.76
A1
  Bottom 0.406: U$3.B8 14.67,30.59 19.77,35.69 R28.2
A1O  (via drill 0.35)
  Top 0.305: IC4.1 28.92,33.83 R13.1 30.19,34.01 30.43,33.77
  Top 0.406: C5.2 30.43,33.77 30.43,32.8 v30.48,32.75
  TopMiddle 0.406: v30.48,32.75 30.48,32.68 42.43,20.72 52.18,20.72 v52.27,20.63
  Bottom 0.305: v30.48,32.75 30.41,32.75 C6.2
  Bottom 0.406: IC1.61 52.34,20.56 v52.27,20.63
A2
  Bottom 0.406: U$3.B9 18.21,23.43 18.7,23.92 18.7,25.63 20.4,27.32 20.4,29.89 R16.2
A2O  (via drill 0.35)
  Top 0.305: 30.71,29.7 C16.2 | 30.71,29.7 30.71,28.26 v30.73,28.23 | 30.71,29.7 30.62,29.79 R15.1 29.23,29.77 IC7.1
  Top 0.406: v30.73,28.23 v30.74,28.22
  TopMiddle 0.406: v30.74,28.22 v30.74,28.21 39.03,19.92 51.35,19.92 v51.47,19.81
  Bottom 0.305: v30.74,28.22 30.74,28.41 C17.2
  Bottom 0.406: IC1.60 51.51,19.76 v51.47,19.81
A3
  Bottom 0.406: U$3.B10 18.9,20.43 19.71,21.24 19.71,24.63 R19.2
A3O  (via drill 0.35)
  Top 0.305: IC8.1 27.76,25.23 R18.1 29.36,25.15 C25.2 30.84,23.59 30.79,23.54
  Top 0.406: 30.79,23.54 v30.81,23.53
  TopMiddle 0.406: v30.81,23.53 30.81,23.45 35.36,18.9 52.19,18.9 v52.27,18.98
  Bottom 0.305: C26.2 29.16,25.18 v30.81,23.53
  Bottom 0.406: IC1.59 52.29,18.96 v52.27,18.98
A4
  Bottom 0.406: U$3.B11 18.82,17.43 20.75,19.36 20.75,21.01 R22.2
A4O  (via drill 0.35)
  Top 0.305: 30.73,19.06 30.67,19.11 C29.2 29.35,20.61 R21.1 27.74,20.64 IC9.1
  Top 0.406: 30.73,19.06 v30.71,19.04
  TopMiddle 0.406: v30.71,19.04 30.88,19.04 31.76,18.16 v51.43,18.16
  Bottom 0.305: C30.2 29.25,20.5 v30.71,19.04
  Bottom 0.406: v51.43,18.16 53.73,18.16 IC1.58
A5
  Bottom 0.406: U$3.B12 18.43,14.43 20.18,16.18 20.18,17.1 20.83,17.75 21.94,17.75 R25.2
A5O  (via drill 0.35)
  Top 0.305: v32.51,15.99 32.45,16.05 C33.2 29.41,16.05 29.4,16.06 | IC10.1 29.39,16.05 29.4,16.06 | 29.4,16.06 R24.1
  TopMiddle 0.406: v32.51,15.99 32.66,15.99 34.02,17.34 52.24,17.34 v52.27,17.37
  Bottom 0.305: C34.2 32.35,16.15 v32.51,15.99
  Bottom 0.406: IC1.57 v52.27,17.36 v52.27,17.37
A6
  Bottom 0.406: U$3.B13 18.15,11.43 20.06,13.35 21.91,13.35 R29.2
A6O  (via drill 0.35)
  Top 0.305: IC11.1 29.36,11.48 R27.1 C39.2 31.6,10.97 v34.78,10.97
  Top 0.406: 34.72,11.03 v34.78,10.97
  TopMiddle 0.406: v34.78,10.97 34.78,15.16 36.2,16.58 51.31,16.58 v51.34,16.6
  Bottom 0.305: v34.78,10.97 30.14,10.97 C40.2
  Bottom 0.406: IC1.56 51.37,16.56 v51.34,16.6
A7
  Bottom 0.406: U$3.B18 11.95,14.43 13.22,13.16 13.22,9.37 15.32,7.27 18.34,7.27 19.79,8.72 21.83,8.72 R32.2
A7O  (via drill 0.35)
  Top 0.305: IC12.1 29.45,6.91 R31.1 29.63,7.09 C43.2 32.86,7.09 33.53,6.42
  Top 0.406: 33.53,6.42 v33.56,6.39
  TopMiddle 0.406: v33.56,6.39 34.33,6.39 43.72,15.77 52.21,15.77 v52.23,15.75
  Bottom 0.305: C44.2 32.89,7.06 v33.56,6.39
  Bottom 0.406: IC1.55 52.25,15.76 v52.23,15.75
A8
  Bottom 0.406: U$3.B19 11.67,8.77 16.32,4.13 21.73,4.13 R35.2
A8O  (via drill 0.35)
  Top 0.305: v33.02,2.24 32.76,2.5 C47.2 30.16,2.5 R34.1 29.95,2.34 IC13.1
  TopMiddle 0.406: v33.02,2.24 33.13,2.24 v44.25,13.36
  Bottom 0.305: 32.8,2.46 v33.02,2.24 32.78,2.48 C48.2
  Bottom 0.406: v44.25,13.36 44.31,13.36 44.93,13.98 48.11,13.98 R12.2
AGND  (via drill 0.35)
  Top 0.305: C5.1 31.07,35.72 32,34.78 32,32.78 C16.1 | C16.1 30.73,31.49 32,30.21 32,28.02 C25.1 | C25.1 30.84,26.81 32,25.64 32,23.64 30.72,22.36 | 30.72,22.36 C29.1 30.76,22.31 32,21.07 32,18.89 30.89,17.78 | 30.89,17.78 C33.1 34.89,17.74 35.56,17.07 | U$5.HEATGND 34.78,17.07 C39.1 | C15.2 | C15.2 24.2,32.08 24.2,32.1 24.84,32.73 29.48,32.73 30.05,32.17 30.05,32.14 C16.1 | C25.1 30.09,27.6 30.09,27.61 29.48,28.22 24.64,28.22 23.61,27.19 C22.2 23.61,27.97 v23.46,28.11 | C28.2 23.48,22.59 23.48,22.76 24.46,23.74 25.68,23.74 25.72,23.78 29.36,23.78 30.12,23.02 30.12,22.96 30.72,22.36 | C32.2 23.45,18.65 v24.02,19.22 | 30.89,17.78 30.23,18.45 30.23,18.46 29.32,19.36 24.16,19.36 v24.02,19.22 | C36.2 23.43,13.44 v24.43,14.44 24.81,14.82 29.45,14.82 C39.1 | C42.2 23.61,8.79 24.99,10.17 29.7,10.17 31.05,8.83 | 31.05,8.83 C43.1 | C39.1 31.52,13.28 v32.05,12.75 | 31.05,8.83 v32.08,9.86 36.31,5.62 U11.1 | C46.2 23.42,4.35 24.89,5.83 v29.97,5.83 30.1,5.83 C47.1 31.72,5.33 v32.21,5.82 | C13.1 52.16,6.68 51.31,5.83 46.23,5.83 v45.21,6.84 44.7,7.35 44.7,9.89 43.81,10.78 IC6.5 | v40.64,27.16 41.13,27.16 41.91,26.39 41.91,25.33 C37.2 | v23.5,32.74 23.5,31.6 C15.2 | C4.2 22.23,35.68 20.83,34.28 20.83,32.83 20.87,32.79 | 20.87,32.79 v20.89,32.77 | v18.29,36.31 18.29,35.8 19.81,34.28 19.81,33.26 20.32,32.75 20.83,32.75 20.87,32.79 | v24.02,19.22
  Top 0.406: U$3.B14 U$3.B15 U$3.B16 U$3.B17 | U$5.HEATGND 35.97,17.29 35.56,17.29 v35.57,20.36 | U$5.HEATGND 35.56,17.07 35.09,17.07 | C37.2 41.49,25.3 40.64,26.15 U$10V2V5.P4 | v39.12,1.39 37.1,1.39 U11.4 | U$5.HEATGND U$5.GND | v47.75,14.97 47.75,15.96 R4.1 | U$5.HEATGND 36.66,17.07 41.6,12.13 41.6,10.81 IC6.5 | v23.3,23.81 23.3,22.77 23.48,22.59 | C42.2 v23.48,10.02
  Top 0.508: R37.1 v20.83,14.97 | IC2.2 70.02,4.22 v70.61,4.81
  Top 0.61: R4.1 46.69,14.94 C9.2
  TopMiddle 0.305: v32.05,12.75 32.05,9.88 v32.08,9.86 32.21,9.72 v32.21,5.82 | v20.89,32.77 23.48,32.77 v23.5,32.74
  TopMiddle 0.406: v45.21,6.84 47.75,9.38 v47.75,14.97 | U$3.B14 11.67,27.43 14.11,29.87 20.02,29.87 21.82,28.08 23.43,28.08 v23.46,28.11
  TopMiddle 0.508: v20.83,14.97 21.34,14.97 21.84,14.46 | v70.61,4.81 70.61,6.34
  Bottom 0.305: C10.2 v40.63,27.16 v40.64,27.16 | v23.46,28.11 23.46,27.06 C21.2 | C14.2 v23.52,32.73 v23.5,32.74 | C3.2 23.46,35.74 22.66,36.54 18.74,36.54 18.51,36.31 v18.29,36.31
  Bottom 0.406: R59.2 39.91,3.02 C69.1 43.55,5.18 v45.21,6.84 | R59.2 39.63,1.91 v39.12,1.39 | v35.57,20.36 36.35,21.35 C38.2 38,19.84 C10.2 49.49,19.84 51.14,21.49 52.39,21.49 53.08,22.18 53.72,22.18 IC1.63 | C27.2 23.61,23.51 v23.3,23.81 | v23.48,10.02 23.48,8.91 C41.2 | C35.2 23.53,13.54 v24.43,14.44 | C45.2 23.7,4.24 24.57,5.11 29.25,5.11 v29.97,5.83 | R59.2 39.63,3.3 40.64,4.3 40.64,5.83 40.13,6.34 37.59,6.34 36.58,5.32 36.58,4.92 C68.2 | C31.2 23.62,18.82 v24.02,19.22
  pour TopMiddle: 6.6,17.51 89.92,18.02 90.93,18.02 90.93,0.75 88.9,-1.28 6.6,-0.78
AVR_SCK  (via drill 0.35)
  Top 0.305: H7.3 66.04,29.7 66.04,28.69 v63.5,26.15
  Bottom 0.305: v63.5,26.15 IC1.11
CAN_H  (via drill 0.35)
  Top 0.406: IC2.7 59.63,4.17 58.44,4.17 58.26,3.98 IC3.2 52.9,3.98 v51.94,3.02
  BottomMiddle 0.406: v51.94,3.02 45.76,3.02 45.71,2.98 33.53,2.98 | 33.53,2.98 33.35,2.98 | 33.53,2.98 14.03,2.98 7.62,9.38 7.62,11.38 U$3.B25
CAN_L  (via drill 0.35)
  Top 0.406: IC2.6 59.66,5.47 58.25,5.47 57.83,5.89 IC3.1 53.13,5.89 v51.09,3.84
  BottomMiddle 0.406: v51.09,3.84 45.79,3.84 45.48,3.54 27.73,3.54 26.74,4.53 14.58,4.53 U$3.B26
D+  (via drill 0.35)
  Top 0.254: 81.71,26.23 IC5.15 82.59,26.23 v82.83,25.98
  BottomMiddle 0.254: v82.83,25.98 82.83,25.95 82.22,25.34 82.21,25.34 81.95,25.08 81.95,19.6 82.99,18.57 84.65,18.57 U$1.P$3
D-  (via drill 0.35)
  Top 0.254: v82.93,27.2 82.44,27.2 82.11,26.87 IC5.16
  BottomMiddle 0.254: U$1.P$2 84.44,17.56 83.9,18.11 82.69,18.11 81.55,19.25 81.55,25.82 v82.93,27.2
DGND  (via drill 0.35)
  Top 0.305: IC5.7 74.02,30.79 75.6,30.79 78.19,28.19 78.99,28.19 79,28.17 IC5.18 82.29,28.17 82.8,28.69 82.8,29.76 82.43,30.13 81.27,30.13 IC5.21 79.36,30.11 78.56,30.91 78.56,32.11 79.18,32.73 IC5.25
  Top 0.406: U$26.1 47.31,35.73 v47.75,35.29 | v47.75,35.29 47.75,34.3 VCC!.C | U$2.1 13,35.59 v11.18,33.77 9.14,31.74 9.14,27.96 U$3.B20 U$3.B21 U$3.B22 U$3.B23 U$3.B24 | C23.2 34.76,35 v35.05,35.29 | v47.75,35.29 56.39,35.29 57.4,34.28 H7.6 57.91,34.34 | C24.2 46.23,26.03 v46.23,24.12 46.23,23.61 50.29,19.54 50.29,15.48 51.31,14.46 v55.88,14.46 | IC3.3 53.61,4.93 v53.53,5.01 | v73.15,22.59 73.15,23.81 C19.2 | IC5.7 73.21,30.77 v72.14,29.7 | 57.91,34.34 v57.91,35.8 | v65.83,32.55 65.51,32.55 65.06,33.01 59.24,33.01 57.91,34.34 | IC5.26 IC5.25
  Top 0.508: R37.2 v20.83,24.12
  TopMiddle 0.406: v11.18,33.77 28.45,33.77 29.97,35.29 v35.05,35.29 v47.75,35.29 47.75,33.77 46.23,32.24 v46.23,24.12 71.63,24.12 v73.15,22.59 | 9.14,27.96 U$3.B20 | v55.88,14.46 55.88,11.92 53.53,9.58 v53.53,5.01 60.14,5.01 v61.47,6.34 | U$3.B21 U$3.B2
  TopMiddle 0.508: v20.83,24.12 21.84,25.13
  Bottom 0.305: C2.1 73.16,21.31 70.82,18.97 IC1.22
  Bottom 0.406: v55.88,14.46 55.88,14.43 55.59,14.14 53.76,14.14 IC1.53 | 63.25,6.34 v61.47,6.34 | 63.25,6.34 R3.2 | 73.16,22.58 C2.1 | 73.16,22.58 v73.15,22.59 | C18.2 76.25,25.95 75.99,25.69 75.99,23.4 75.18,22.59 73.17,22.59 73.16,22.58 | v72.14,29.7 72.14,27.16 72.64,26.66 76.22,26.66 C18.2 | C1.1 72.95,7.66 71.63,6.34 63.25,6.34 | C7.2 59.91,33.8 v57.91,35.8 | SJ2.1 65.55,32.27 v65.83,32.55 | C18.2 80.03,26.63 82.8,23.85 84.95,23.85 85.67,23.12 85.67,20.78 85.3,20.41 | 85.3,20.41 85.18,20.28 | U$1.P$5 85.3,20.41
  pour TopMiddle: 6.6,37.83 89.41,38.34 90.93,36.82 90.93,21.07 90.42,19.04 6.6,18.53
DTR
  Top 0.305: C20.1 72.1,33.28 72.84,34.03 IC5.2
M8RXD
  Top 0.305: R2.1 73.39,35.29 IC5.1
M8TXD
  Top 0.305: R7.1 72.23,31.31 72.99,32.07 IC5.5
N$1
  Top 0.813: F3.2 15.05,30.05 U$3.B1
N$2
  Top 0.508: U$5.ENABLE 44.63,19.61 R5.2 44.66,17.15 R4.2
N$5
  Bottom 0.305: C6.1 28.38,35.73 25.91,33.26 24.68,33.26 R1.2 22.43,34.38 R28.1
N$6  (via drill 0.35)
  Top 0.406: v62.86,2.95 IC2.8
  Bottom 0.406: R3.1 63.28,3.37 v62.86,2.95
N$9
  Top 0.508: VCC!.A 48.12,29.96 R6.1
N$11
  Bottom 0.406: IC1.24 71.78,17.36 72.14,17 72.14,10.58 C1.2 76.65,9.76 Q1.1
N$17  (via drill 0.35)
  Top 0.305: v26.44,35.71 27.7,35.71 IC4.3
  Bottom 0.305: v26.44,35.71 26.41,35.74 C3.1 25.26,35.72 R1.1
N$18
  Bottom 0.406: R12.1 R11.1 51.64,13.96 52.62,14.95 53.72,14.95 IC1.54
N$19
  Top 0.305: IC4.4 25.11,36.16 25.5,36.55 28.25,36.55 R13.2
N$20  (via drill 0.35)
  Top 0.406: IC6.7 43.05,8.24 v43.69,8.88
  Bottom 0.406: v43.69,8.88 43.69,10.23 C8.1
N$21
  Top 0.406: IC6.2 50.59,8.24 C11.1
N$22
  Bottom 0.406: L1.2 IC1.64 | IC1.64
N$23  (via drill 0.35)
  Top 0.406: IC6.1 46.61,6.97 46.23,7.35 46.23,7.86 v45.71,8.38
  Bottom 0.406: C8.2 45.55,8.53 v45.71,8.38
N$24
  Top 0.406: IC6.3 50.59,9.51 C11.2
N$25  (via drill 0.35)
  Top 0.305: IC7.3 27.38,31.33 27,31.33 26.53,30.86 v26.36,30.86
  Bottom 0.305: R14.1 25.22,29.72 C14.1 26.02,31.2 v26.36,30.86
N$26
  Top 0.305: R15.2 29.23,31.49 28.45,32.27 25.96,32.27 25.36,31.67 IC7.4
N$27
  Bottom 0.305: C17.1 29.26,31.53 26.92,29.2 26.91,29.2 26.54,28.83 24.41,28.83 R14.2 23.38,29.86 R16.1
N$28  (via drill 0.35)
  Top 0.305: U11.3 35.51,2.83 35.16,2.48 R58.2 34.75,2.13 v35.47,1.41
  Bottom 0.305: v35.47,1.41 37.32,1.41 37.94,2.03 R59.1
N$29
  Top 0.305: U11.6 41.03,2.84 41.49,2.38 41.49,2.35 41.64,2.2 41.7,2.13 43.93,2.13 44.05,2.25 C67.2 45.31,2.98 46.03,3.7 46.03,5.01 | 46.03,5.01 46.03,5.02 | 46.03,5.01 45.47,5.58 | 45.47,5.58 45.46,5.59 | 45.47,5.58 40.57,5.58 R60.2 40.53,5.43 41.15,4.81 41.81,4.81 R61.1
N$30  (via drill 0.35)
  Top 0.305: v26.41,26.96 27.58,26.96 IC8.3
  Bottom 0.305: v26.41,26.96 26.4,26.94 C21.1 25.28,25.36 R17.1
N$31
  Top 0.305: R18.2 29.22,26.93 28.45,27.7 25.71,27.7 IC8.4
N$32  (via drill 0.35)
  Top 0.305: v79.41,31.42 IC5.23
  Bottom 0.305: LED2.C 78.02,32.82 v79.41,31.42
N$33
  Bottom 0.305: R19.1 23.49,25.26 R17.2 24.39,24.55 25.96,24.55 26.04,24.62 26.92,24.62 29.16,26.85 C26.1
N$34
  Top 0.305: IC5.22 83.36,30.77 LED3.C
N$35
  Bottom 0.305: LED2.A 75.92,31.08 R8.1
N$36
  Top 0.305: LED3.A 83.88,25.71 82.2,24.04 78.67,24.04 R9.1
N$37  (via drill 0.35)
  Top 0.305: IC9.3 26.52,22.53 v26.5,22.51
  Bottom 0.305: 25.4,22.51 v26.5,22.51 | 25.4,22.51 25.32,22.51 C27.1 | R20.1 25.23,22.33 25.4,22.51
N$38
  Top 0.305: R21.2 29.32,22.48 28.47,23.32 25.91,23.32 IC9.4
N$39
  Bottom 0.305: 23.48,20.72 R22.1 | 23.48,20.72 R20.2 | C30.1 29.01,22.38 27.95,21.32 27.95,20.34 27.43,19.83 24.38,19.83 23.48,20.72
N$40  (via drill 0.35)
  Top 0.305: IC10.3 26.45,17.95 v26.43,17.93
  Bottom 0.305: 25.4,17.93 v26.43,17.93 | 25.4,17.93 25.34,17.93 C31.1 | R23.1 25.25,17.79 25.4,17.93
N$41
  Top 0.305: IC10.4 25.11,18.15 25.77,18.81 28.39,18.81 R24.2
N$42
  Bottom 0.305: R25.1 22.17,16.27 R23.2 24.36,15.47 25.93,15.47 25.94,15.48 26.92,15.48 29.3,17.85 C34.1
N$43  (via drill 0.35)
  Top 0.305: IC11.3 26.48,13.38 v26.42,13.45
  Bottom 0.305: R26.1 25.21,13.4 C35.1 25.26,13.45 v26.42,13.45
N$44
  Top 0.305: IC11.4 25.11,13.59 25.75,14.23 28.52,14.23 R27.2
N$45
  Bottom 0.305: 23.37,11.66 R26.2 | 23.37,11.66 R29.1 | C40.1 29.28,13.26 26.92,10.91 25.94,10.91 25.89,10.86 24.17,10.86 23.37,11.66
N$46  (via drill 0.35)
  Top 0.305: v26.42,8.77 27.68,8.77 IC12.3
  Bottom 0.305: R30.1 25.34,8.75 C41.1 26.38,8.81 v26.42,8.77
N$47
  Top 0.305: IC12.4 25.11,8.88 25.88,9.65 28.71,9.65 R31.2
N$48
  Bottom 0.305: R32.1 23.63,7.07 R30.2 24.61,6.09 27.72,6.09 28.11,6.47 28.11,7.4 29.43,8.72 C44.1
N$49  (via drill 0.35)
  Top 0.305: IC13.3 26.86,4.24 v26.4,3.78
  Bottom 0.305: R33.1 C45.1 25.72,3.78 v26.4,3.78
N$50
  Top 0.305: IC13.4 25.11,4.34 25.83,5.07 28.45,5.07 | 28.45,5.07 28.64,5.07 | 28.45,5.07 29.29,5.07 R34.2
N$51
  Bottom 0.305: R35.1 R33.2 24.37,1.62 27.14,1.62 27.15,1.64 28.09,1.64 30.55,4.1 C48.1
RESET  (via drill 0.35)
  Top 0.406: C20.2 69.72,33.26 v68.07,33.26 66.55,33.26 65.53,34.28 H7.5
  Bottom 0.305: D3.A 61.61,33.3 C7.1 63.98,31.23 SJ2.2
  Bottom 0.406: D3.A 67.91,33.43 v68.07,33.26 68.07,30.72 70.61,28.18 70.61,21.07 70.1,20.56 IC1.20 | R10.1 57.91,31.23 58.93,30.21 60.59,30.21 C7.1
RX  (via drill 0.35)
  Top 0.305: R2.2 67.37,35.29 v67.37,35.28 | H7.4 58.93,31.74 59.94,30.72 59.94,28.69 58.91,27.65 v56.32,27.65
  TopMiddle 0.305: v67.37,35.28 63.95,35.28 v56.32,27.65
  Bottom 0.305: v56.32,27.65 56.32,24.75 IC1.2
RXCAN  (via drill 0.35)
  Top 0.406: v66.04,11.42 66.04,6.97 IC2.4
  Bottom 0.406: IC1.31 66.39,11.76 v66.04,11.42
SG  (via drill 0.35)
  Top 0.406: U11.2 37.28,3.48 37.59,3.8 37.59,5.32 v33.53,9.38
  TopMiddle 0.406: v33.53,9.38 33.53,12.43 23.88,22.08 17.32,22.08 U$3.B3
SG5V  (via drill 0.35)
  Top 0.406: v34.77,5.45 34.77,4.19 R58.1
  Top 0.508: v40.64,15.78 42.36,15.78 U$5.VOUT
  BottomMiddle 0.406: 34.73,5.49 v34.77,5.45
  Bottom 0.406: v40.64,15.78 40.64,12.8 34.77,6.93 v34.77,5.46 v34.77,5.45
  Bottom 0.508: C10.1 v40.63,15.79 v40.64,15.78
SGO  (via drill 0.35)
  Top 0.305: U11.7 41.27,3.48 41.79,2.97 42.34,2.97 C67.1 42.56,2.98 43.37,3.78 43.57,3.78 R61.2
  Top 0.406: R61.2 45.17,4.27 v45.21,4.3
  Bottom 0.406: v45.21,4.3 45.21,3.05 C69.2 45.58,3.02 51.53,8.97 51.53,12.26 R11.2
TX  (via drill 0.35)
  Top 0.305: R7.2 67.13,31.31 v67.09,31.35 | H7.1 61.68,29.2 58.89,26.4 57.15,26.4 v57.11,26.44
  TopMiddle 0.305: v67.09,31.35 62.03,31.35 v57.11,26.44
  Bottom 0.305: v57.11,26.44 57.11,24.74 IC1.3
TXCAN  (via drill 0.35)
  Top 0.406: v64.01,12.43 64.01,3.32 64.34,2.99 65.79,2.99 IC2.1
  Bottom 0.406: IC1.30 64.14,12.56 v64.01,12.43
VCC  (via drill 0.35)
  Top 0.305: IC5.19 IC5.20 78.82,29.48 | 78.82,29.48 v78.81,29.46 | v76.72,25.39 76.72,24.08 R9.2 | IC5.4 75.57,32.73 78.82,29.48 | v55.88,29.2 H7.2
  Top 0.406: v47.75,27.67 46.29,27.67 C24.1 | v71.63,25.64 73.23,25.64 73.89,24.98 73.89,24.97 C19.1 76.72,24.08 R9.2 76.75,19.67 82.22,14.2 84.16,14.2 84.85,14.99 84.86,14.98 U$1.P$1 | IC2.3 66.72,5.49 67.56,6.34 v67.56,19.54 | v39.1,4.27 40.28,4.27 U11.8 | IC6.6 39.41,9.51 39.2,9.3 | 39.2,9.3 C12.2 | v39.62,10.4 39.12,9.89 39.12,9.38 39.2,9.3 | U$3.B7 17.17,3.19 v15.75,1.76
  Top 0.508: U$26.2 41.9,30.17 U$26.4 46.19,29.93 | 46.19,29.93 R6.2 | C24.1 46.18,29.92 46.19,29.93
  BottomMiddle 0.305: v78.81,29.46 78.81,28.78 76.72,26.69 v76.72,25.39
  BottomMiddle 0.406: U$3.B7 U$3.B6 U$3.B5 U$3.B4 | v47.75,27.67 50.8,27.67 53.85,24.62 70.61,24.62 v71.63,25.64 | v33.53,1.39 16.12,1.39 v15.75,1.76 | v39.1,4.27 39.1,9.88 v39.62,10.4 48.97,10.4 58.62,20.05 67.06,20.05 v67.56,19.54
  Bottom 0.305: v78.81,29.46 78.81,30.09 R8.2 | R10.2 55.74,29.33 v55.88,29.2
  Bottom 0.406: L1.1 48.73,26.7 v47.75,27.67 47.75,29.7 49.28,31.23 R10.2 55.74,32.69 56.46,33.4 57.76,33.4 D3.C | v71.63,25.64 71.63,20.56 70.83,19.76 IC1.21 68.07,19.76 67.85,19.54 v67.56,19.54 67.06,19.54 60.96,13.45 53.82,13.45 IC1.52 | v39.1,4.27 38.95,4.12 C68.1 37.33,4.12 36.48,3.27 35.4,3.27 v33.53,1.39
  pour BottomMiddle: 7.62,38.34 88.9,38.34 90.42,36.82 90.42,1.26 88.39,-0.78 7.11,-0.78 6.6,-0.27 6.6,37.32
VCC3O  (via drill 0.35)
  Top 0.305: v78.7,27.51 81.24,27.51 IC5.17
  Bottom 0.305: C18.1 77.69,28.53 v78.7,27.51
XTAL1
  Bottom 0.406: IC1.23 71.9,18.16 C2.2 76.66,19.42 Q1.2

### Text on the board
200bmp: /Users/chrisjadams33/Desktop/CPRacingSLO-BW-Final(1).bmp